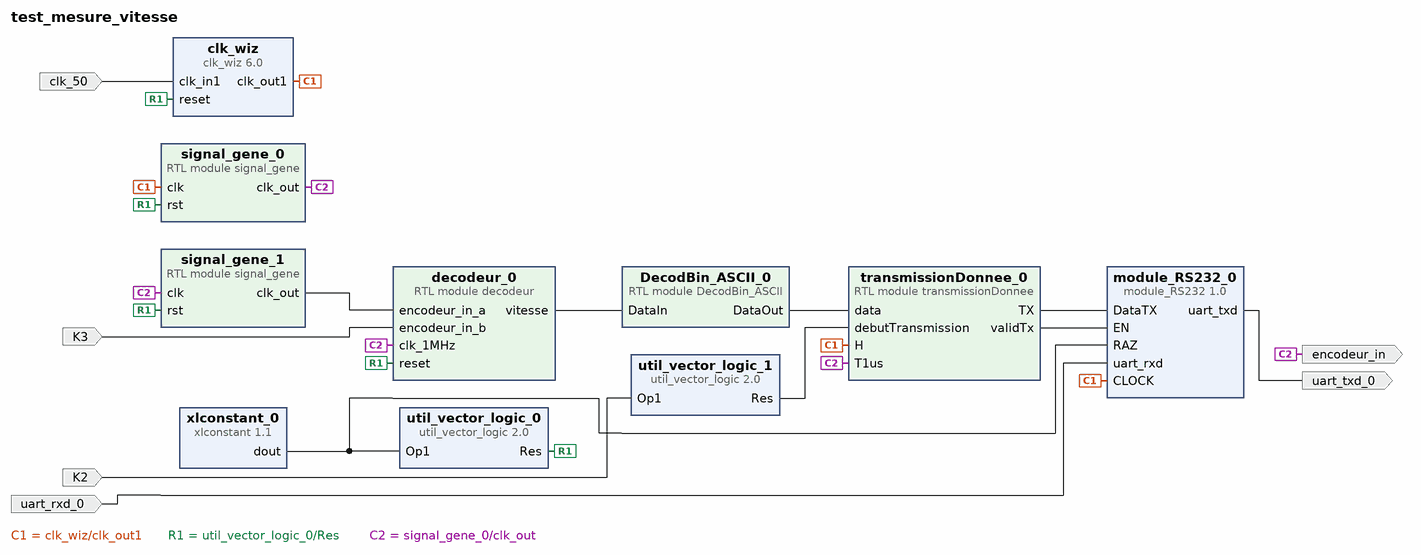
[diagram p0: block diagram of the top level]
# Vivado block design test_mesure_vitesse, xc7z010clg400-1, Vivado 2020.2
create_bd_design test_mesure_vitesse

create_bd_port -dir I -type clk clk_50
set_property -dict {CONFIG.FREQ_HZ 50000000} [get_bd_ports clk_50]
create_bd_port -dir O uart_txd_0
create_bd_port -dir I K2
create_bd_port -dir O encodeur_in
create_bd_port -dir I uart_rxd_0
create_bd_port -dir I K3

create_bd_cell -type ip -vlnv u-ga.fr:user:module_RS232:1.0 module_RS232_0
create_bd_cell -type ip -vlnv xilinx.com:ip:clk_wiz:6.0 clk_wiz
set_property -dict [list \
  CONFIG.CLKIN1_JITTER_PS 200.0 \
  CONFIG.CLKOUT1_DRIVES BUFG \
  CONFIG.CLKOUT1_JITTER 238.699 \
  CONFIG.CLKOUT1_PHASE_ERROR 254.101 \
  CONFIG.CLKOUT1_REQUESTED_OUT_FREQ 125 \
  CONFIG.CLKOUT2_DRIVES BUFG \
  CONFIG.CLKOUT3_DRIVES BUFG \
  CONFIG.CLKOUT4_DRIVES BUFG \
  CONFIG.CLKOUT5_DRIVES BUFG \
  CONFIG.CLKOUT6_DRIVES BUFG \
  CONFIG.CLKOUT7_DRIVES BUFG \
  CONFIG.MMCM_BANDWIDTH OPTIMIZED \
  CONFIG.MMCM_CLKFBOUT_MULT_F 35 \
  CONFIG.MMCM_CLKIN1_PERIOD 20.000 \
  CONFIG.MMCM_CLKIN2_PERIOD 10.0 \
  CONFIG.MMCM_CLKOUT0_DIVIDE_F 7 \
  CONFIG.MMCM_COMPENSATION ZHOLD \
  CONFIG.MMCM_DIVCLK_DIVIDE 2 \
  CONFIG.PLL_CLKIN_PERIOD 20.000 \
  CONFIG.PRIMITIVE PLL \
  CONFIG.PRIM_IN_FREQ 50 \
  CONFIG.USE_LOCKED false \
  CONFIG.USE_RESET true \
] [get_bd_cells clk_wiz]
create_bd_cell -type ip -vlnv xilinx.com:ip:xlconstant:1.1 xlconstant_0
create_bd_cell -type ip -vlnv xilinx.com:ip:util_vector_logic:2.0 util_vector_logic_0
set_property -dict {CONFIG.C_OPERATION not CONFIG.C_SIZE 1} [get_bd_cells util_vector_logic_0]
create_bd_cell -type ip -vlnv xilinx.com:ip:util_vector_logic:2.0 util_vector_logic_1
set_property -dict {CONFIG.C_OPERATION not CONFIG.C_SIZE 1} [get_bd_cells util_vector_logic_1]
create_bd_cell -type module -reference transmissionDonnee transmissionDonnee_0
set_property -dict [list \
  CONFIG.NData 1 \
  CONFIG.dataSize 5 \
  CONFIG.period 8000 \
  CONFIG.periodOctet 1000 \
] [get_bd_cells transmissionDonnee_0]
create_bd_cell -type module -reference signal_gene signal_gene_0
set_property -dict {CONFIG.division_horloge 125 CONFIG.nb_pulse_etat_haut 1} [get_bd_cells signal_gene_0]
create_bd_cell -type module -reference DecodBin_ASCII DecodBin_ASCII_0
create_bd_cell -type module -reference decodeur decodeur_0
create_bd_cell -type module -reference signal_gene signal_gene_1
set_property -dict {CONFIG.division_horloge 20 CONFIG.nb_pulse_etat_haut 10} [get_bd_cells signal_gene_1]

# ---- connections ----

connect_bd_net [get_bd_pins clk_wiz/clk_out1] [get_bd_pins module_RS232_0/CLOCK] [get_bd_pins transmissionDonnee_0/H] [get_bd_pins signal_gene_0/clk]
connect_bd_net [get_bd_pins xlconstant_0/dout] [get_bd_pins util_vector_logic_0/Op1] [get_bd_pins module_RS232_0/RAZ]
connect_bd_net [get_bd_pins util_vector_logic_0/Res] \
  [get_bd_pins clk_wiz/reset] [get_bd_pins signal_gene_0/rst] [get_bd_pins decodeur_0/reset] [get_bd_pins signal_gene_1/rst]
connect_bd_net [get_bd_pins module_RS232_0/uart_txd] [get_bd_ports uart_txd_0]
connect_bd_net -net K2_1 [get_bd_ports K2] [get_bd_pins util_vector_logic_1/Op1]
connect_bd_net -net pulse_generator_0_pulse [get_bd_pins signal_gene_0/clk_out] \
  [get_bd_ports encodeur_in] [get_bd_pins transmissionDonnee_0/T1us] [get_bd_pins decodeur_0/clk_1MHz] \
  [get_bd_pins signal_gene_1/clk]
connect_bd_net [get_bd_pins transmissionDonnee_0/TX] [get_bd_pins module_RS232_0/DataTX]
connect_bd_net [get_bd_pins transmissionDonnee_0/validTx] [get_bd_pins module_RS232_0/EN]
connect_bd_net -net clk_in1_0_1 [get_bd_ports clk_50] [get_bd_pins clk_wiz/clk_in1]
connect_bd_net -net uart_rxd_0_1 [get_bd_ports uart_rxd_0] [get_bd_pins module_RS232_0/uart_rxd]
connect_bd_net [get_bd_pins util_vector_logic_1/Res] [get_bd_pins transmissionDonnee_0/debutTransmission]
connect_bd_net [get_bd_pins DecodBin_ASCII_0/DataOut] [get_bd_pins transmissionDonnee_0/data]
connect_bd_net [get_bd_pins decodeur_0/vitesse] [get_bd_pins DecodBin_ASCII_0/DataIn]
connect_bd_net -net encodeur_in_b_0_1 [get_bd_ports K3] [get_bd_pins decodeur_0/encodeur_in_b]
connect_bd_net [get_bd_pins signal_gene_1/clk_out] [get_bd_pins decodeur_0/encodeur_in_a]

validate_bd_design
save_bd_design
